# Altium schematic sheet Linux_board.va_1.SchDoc
size 843 x 659 mm
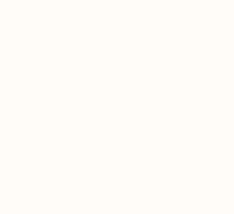
[diagram p0: Linux_board.va_1.SchDoc, top left]
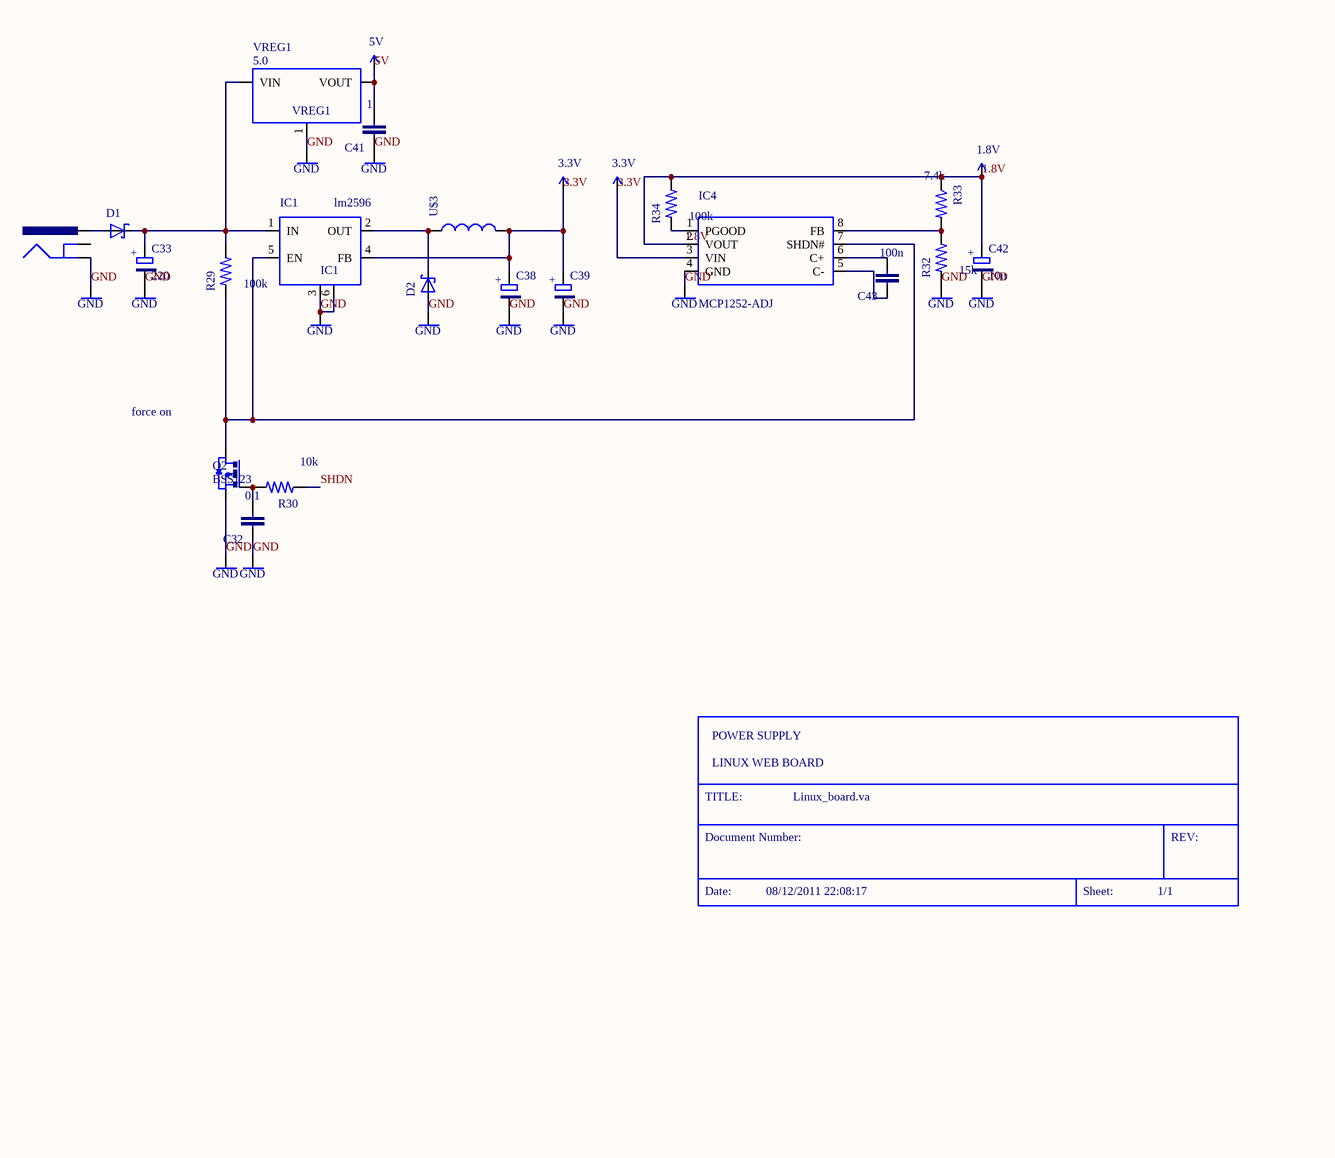
[diagram p1: Linux_board.va_1.SchDoc, top middle]
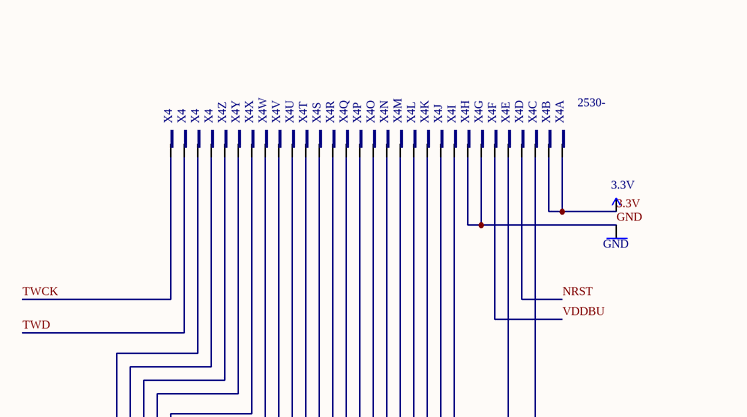
[diagram p2: Linux_board.va_1.SchDoc, top right]
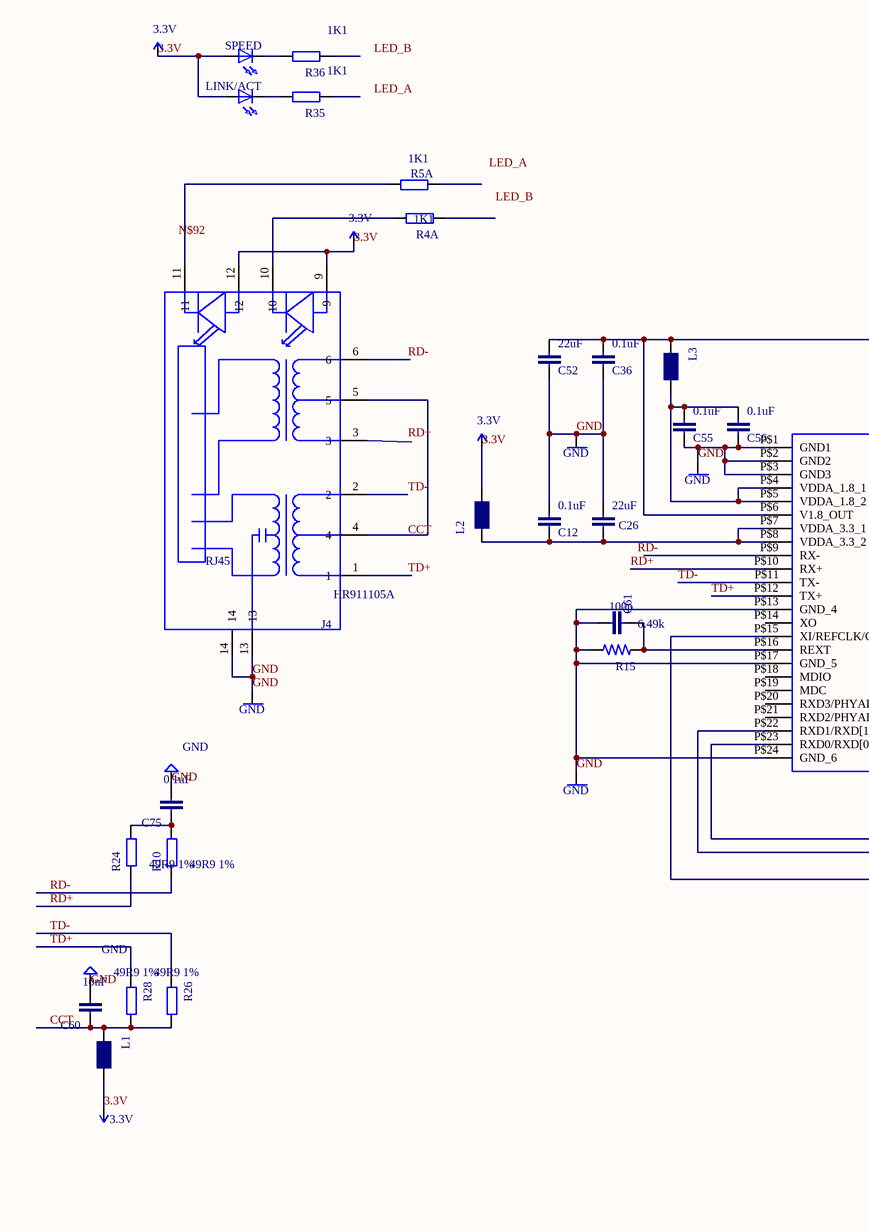
[diagram p3: Linux_board.va_1.SchDoc, bottom left]
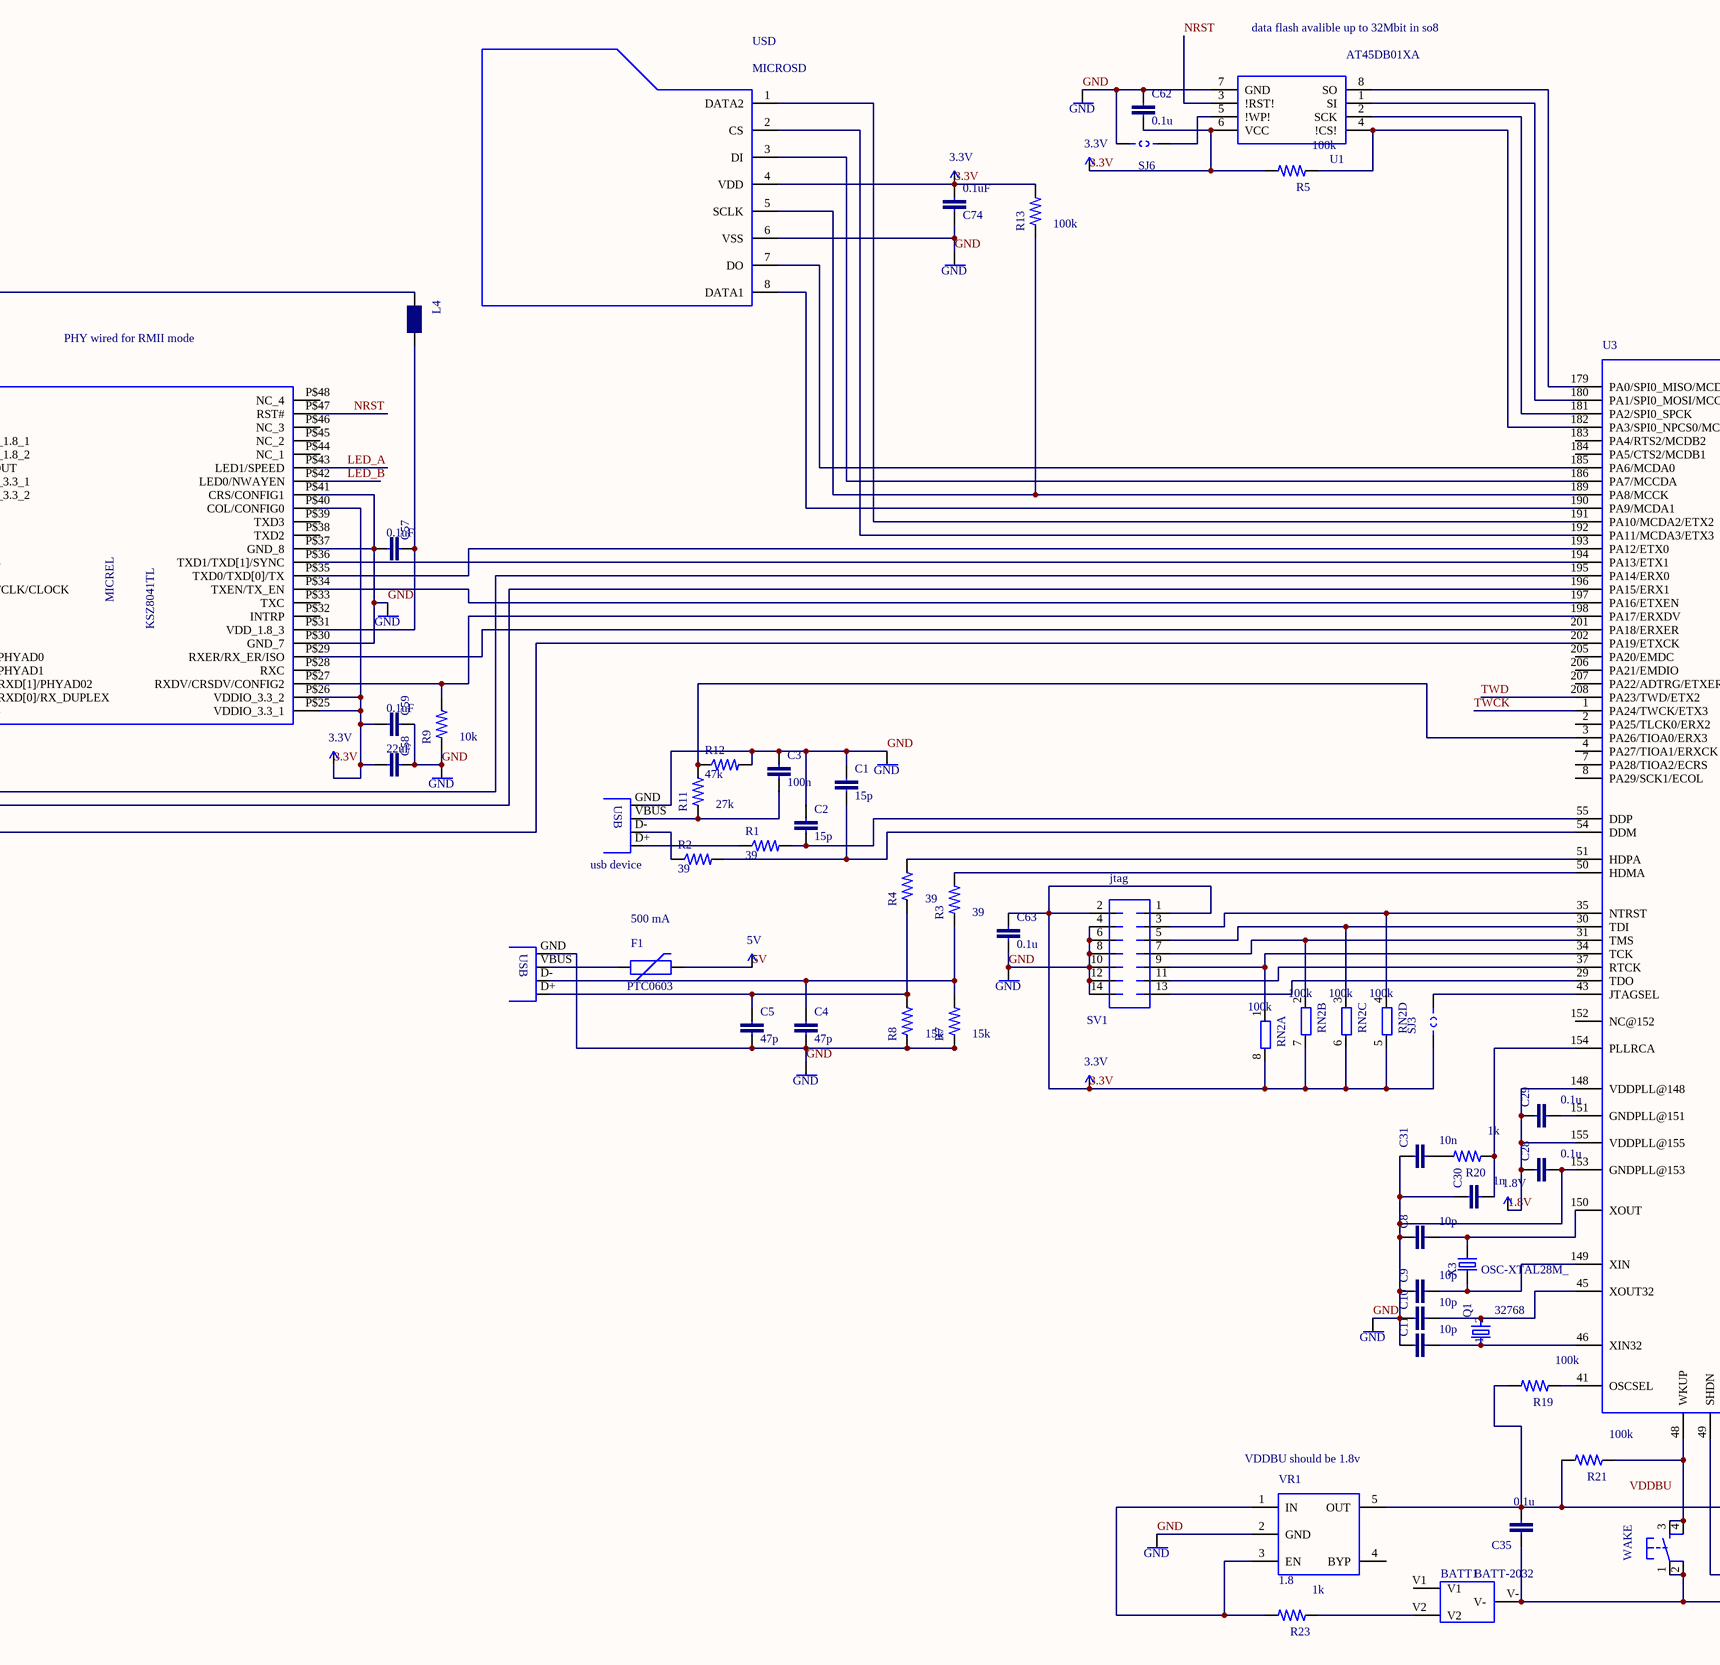
[diagram p4: Linux_board.va_1.SchDoc, bottom middle]
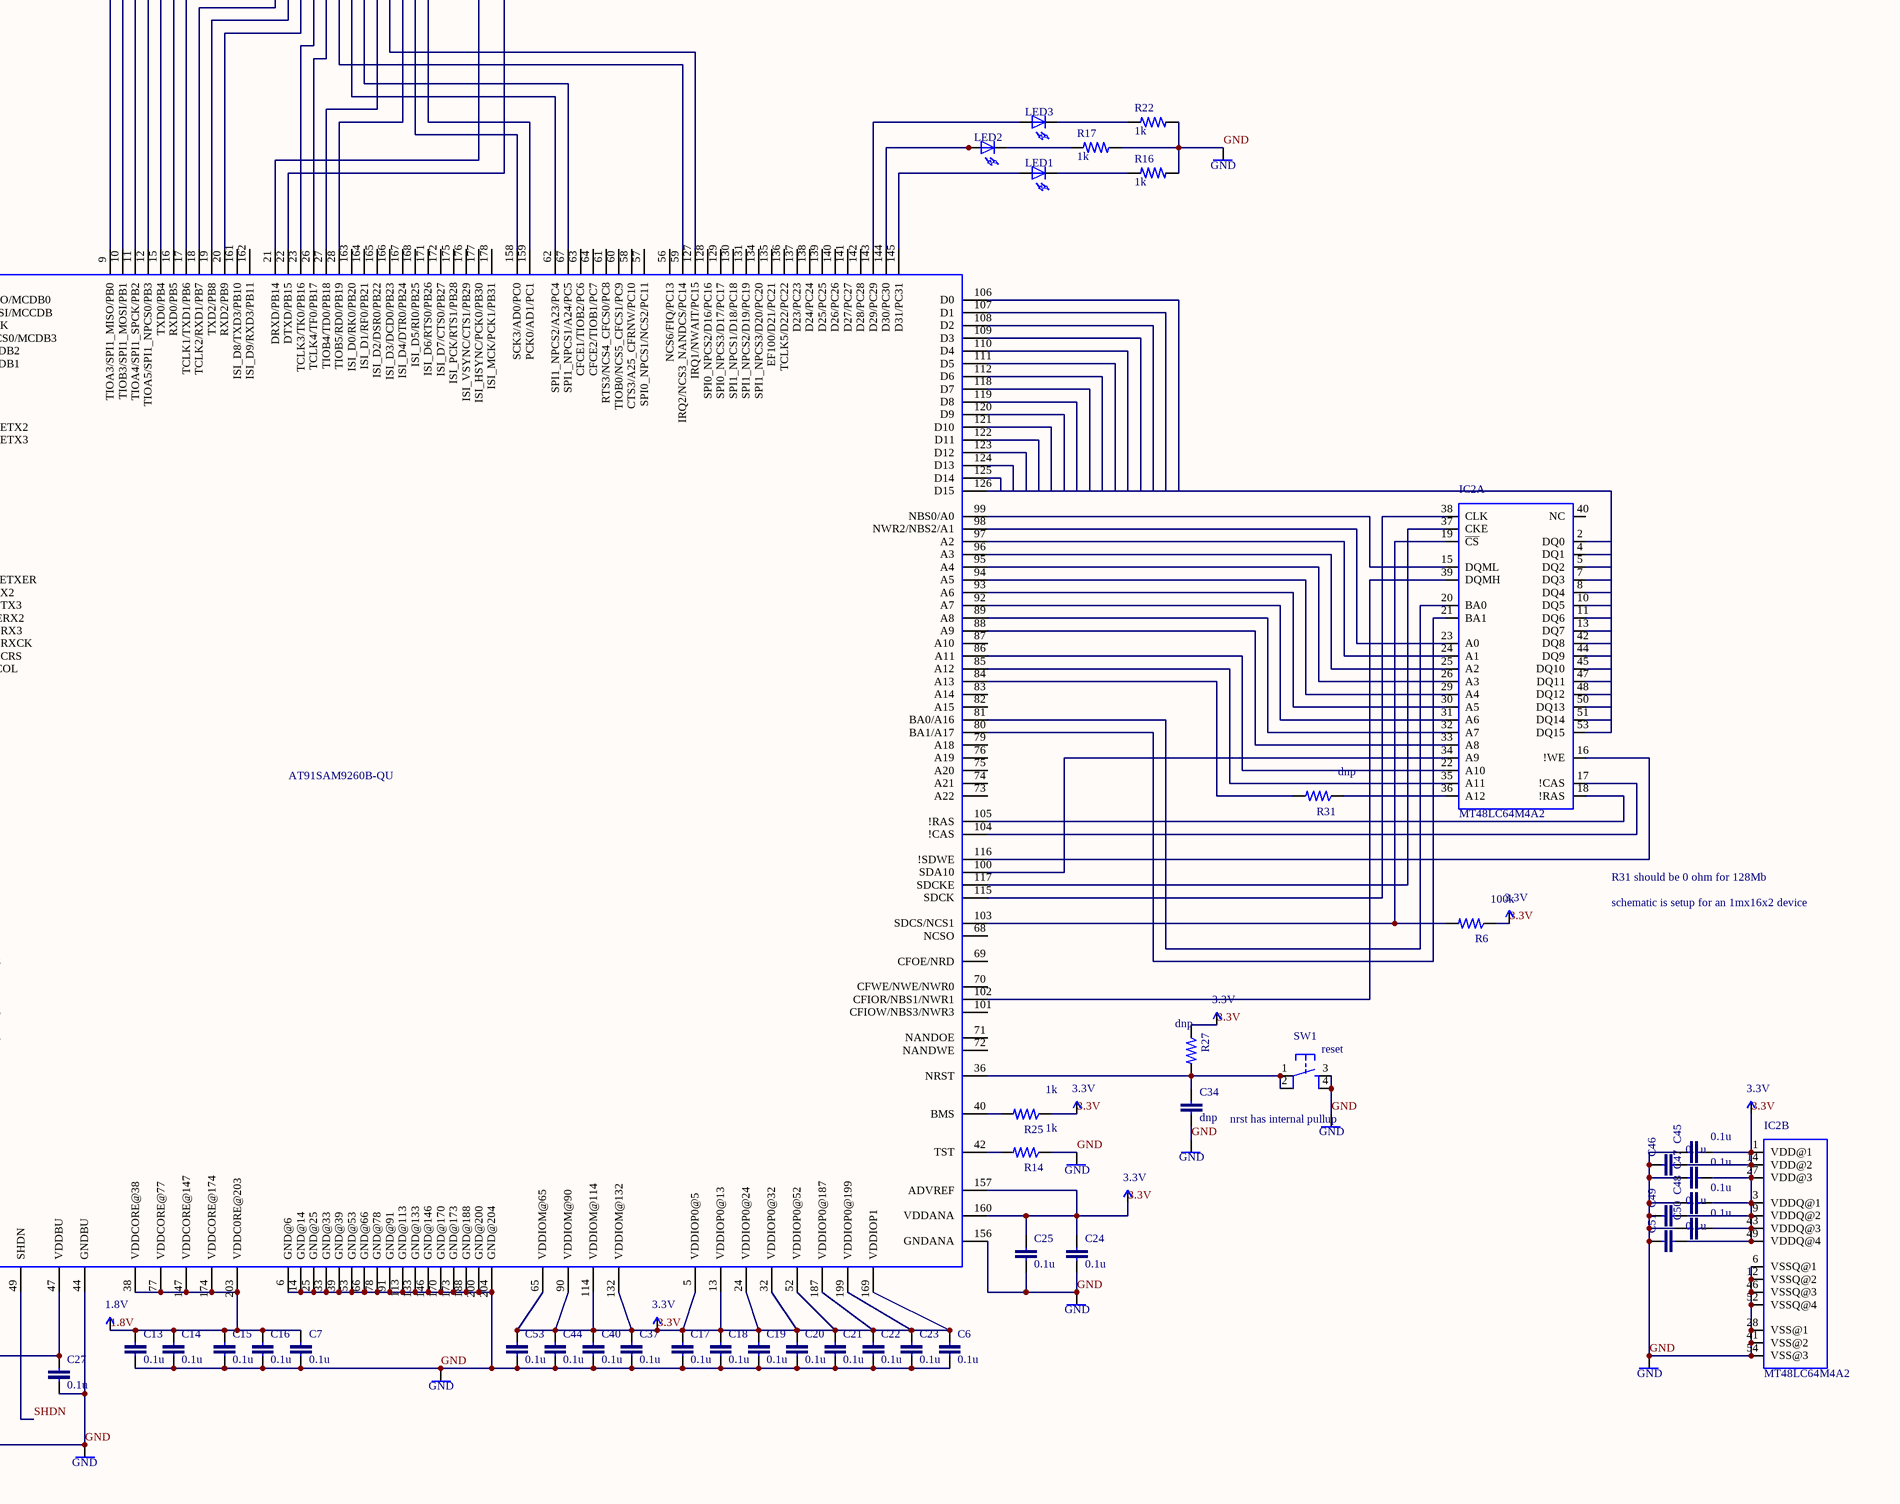
[diagram p5: Linux_board.va_1.SchDoc, bottom right]

## Parts
BATT1  BATT-2032  [2032]
C1  15p  [0603-CAP]
C2  15p  [0603-CAP]
C3  100n  [0603-CAP]
C4  47p  [0603-CAP]
C5  47p  [0603-CAP]
C6  0.1u  [0603-CAP]
C7  0.1u  [0603-CAP]
C8  10p  [0603-CAP]
C9  10p  [0603-CAP]
C10  10p  [0603-CAP]
C11  10p  [0603-CAP]
C12  0.1uF  [C0603]
C13  0.1u  [0603-CAP]
C14  0.1u  [0603-CAP]
C15  0.1u  [0603-CAP]
C16  0.1u  [0603-CAP]
C17  0.1u  [0603-CAP]
C18  0.1u  [0603-CAP]
C19  0.1u  [0603-CAP]
C20  0.1u  [0603-CAP]
C21  0.1u  [0603-CAP]
C22  0.1u  [0603-CAP]
C23  0.1u  [0603-CAP]
C24  0.1u  [0603-CAP]
C25  0.1u  [0603-CAP]
C26  22uF  [C0603]
C27  0.1u  [0603-CAP]
C28  0.1u  [0603-CAP]
C29  0.1u  [0603-CAP]
C30  1n  [0603-CAP]
C31  10n  [0603-CAP]
C32  0.1  [C603]
C33  220  [SMC_B]
C34  dnp  [0603-CAP]
C35  0.1u  [0603-CAP]
C36  0.1uF  [C0603]
C37  0.1u  [0603-CAP]
C38  (no value)  [CASE_A]
C39  (no value)  [SMC_B]
C40  0.1u  [0603-CAP]
C41  1  [C603]
C42  10u  [SMC_B]
C43  100n  [C603]
C44  0.1u  [0603-CAP]
C45  0.1u  [0603-CAP]
C46  0.1u  [0603-CAP]
C47  0.1u  [0603-CAP]
C48  0.1u  [0603-CAP]
C49  0.1u  [0603-CAP]
C50  0.1u  [0603-CAP]
C51  0.1u  [0603-CAP]
C52  22uF  [C0603]
C53  0.1u  [0603-CAP]
C55  0.1uF  [C0603]
C56  0.1uF  [C0603]
C57  0.1uF  [C0603]
C58  22uF  [C0603]
C59  0.1uF  [C0603]
C60  10uF  [C0603]
C61  100p  [C0603]
C62  0.1u  [0603-CAP]
C63  0.1u  [0603-CAP]
C74  0.1uF  [C0603]
C75  0.1uF  [C0603]
D1  (no value)  [SMB]
D2  (no value)  [SMB]
F1  PTC0603  [0603]
FRAME1  (no value)  (parts A,B of 2)
GND1  GND
GND2  GND
GND3  GND
GND4  GND
GND6  GND
GND7  GND
GND8  GND
GND9  GND
GND10  GND
GND11  GND
GND12  GND
GND13  GND
GND14  GND
GND15  GND
GND16  GND
GND17  GND
GND18  GND
GND19  GND
GND20  GND
GND21  GND
GND22  GND
GND23  GND
GND24  GND
GND25  GND
GND26  GND
GND27  GND
GND28  GND
GND29  GND
GND30  GND
GND31  GND
GND32  GND
GND33  GND
GND34  GND
GND35  GND
GND36  GND
IC1  lm2596  [TO263-5]
IC2  MT48LC64M4A2  [TSOP54-400]  (parts A,B of 2)
IC4  MCP1252-ADJ  [MSOP8]
J4  RJ45  [HR911105A]
JP1  (no value)  [STAND-OFF]
JP2  (no value)  [STAND-OFF]
JP3  (no value)  [STAND-OFF]
JP4  (no value)  [STAND-OFF]
L1  (no value)  [WE-KI_0805_B]
L2  (no value)  [WE-KI_0805_B]
L3  (no value)  [WE-KI_0805_B]
L4  (no value)  [WE-KI_0805_B]
LED1  (no value)  [CHIPLED_0805]
LED2  (no value)  [CHIPLED_0805]
LED3  (no value)  [CHIPLED_0805]
LINK/ACT  (no value)  [CHIPLED_0805]
P+1  3.3V
P+2  3.3V
P+3  3.3V
P+4  3.3V
P+5  3.3V
P+6  3.3V
P+7  3.3V
P+8  3.3V
P+9  3.3V
P+10  3.3V
P+11  3.3V
P+12  3.3V
P+13  3.3V
P+14  3.3V
P+15  3.3V
P+16  3.3V
P+17  3.3V
Q1  32768  [TC26H]
Q2  BSS123  [SOT23]
R1  39  [R0603]
R2  39  [R0603]
R3  39  [R0603]
R4  39  [R0603]
R4A  1K1  [R0603]
R5  100k  [R0603]
R5A  1K1  [R0603]
R6  100k  [R0603]
R7  15k  [R0603]
R8  15k  [R0603]
R9  10k  [R0603]
R10  49R9 1%  [R0603]
R11  27k  [R0603]
R12  47k  [R0603]
R13  100k  [R0603]
R14  1k  [R0603]
R15  6.49k  [R0603]
R16  1k  [R0603]
R17  1k  [R0603]
R19  100k  [R0603]
R20  1k  [R0603]
R21  100k  [R0603]
R22  1k  [R0603]
R23  1k  [R0603]
R24  49R9 1%  [R0603]
R25  1k  [R0603]
R26  49R9 1%  [R0603]
R27  dnp  [R0603]
R28  49R9 1%  [R0603]
R29  100k  [R0603]
R30  10k  [R0603]
R31  dnp  [R0603]
R32  15k  [R0603]
R33  7.4k  [R0603]
R34  100k  [R0603]
R35  1K1  [R0603]
R36  1K1  [R0603]
RN2  100k  [RN8P-4R-CRA06S]  (parts A,B,C,D of 4)
SJ3  (no value)  [SJ_2S-NO]
SJ6  (no value)  [SJ_2S-NO]
SPEED  (no value)  [CHIPLED_0805]
SV1  jtag  [MA07-2]
SW1  reset  [TACT_SWITCH_SMALL]
U1  AT45DB01XA  [SO08W]
U3  AT91SAM9260B-QU  [PQFP208]
U$1  (no value)  [48PIN-TQFN]
U$2  (no value)  [POWER_JACK_SMD]
U$3  (no value)  [CDRH125]
U$4  1.8V
U$5  1.8V
U$6  1.8V
U$7  5V
U$10  5V
USD  MICROSD  [MICROSD]
V7  GND
V8  GND
VR1  1.8  [SOT-23-5]
VREG1  5.0  [SOT223]
WAKE  (no value)  [TACT_SWITCH_SMALL]
X1  (no value)  [USB-MB-S]
X2  (no value)  [USB-A-H]
X3  OSC-XTAL28M_  [5X8]
X4  2530-  [PAK100/2500-30]  (parts A,B,C,D,E,F,G,H,I,J,K,L,M,N,O,P,Q,R,S,T,U,V,W,X,Y,Z,27,28,29,30 of 30)

## Nets
1.8V: C7.1 C13.1 C14.1 C15.1 C16.1 C28.1 C29.1 C42.+ IC4.2(VOUT) R33.1 R34.2 U3.38(VDDCORE@38) U3.77(VDDCORE@77) U3.147(VDDCORE@147) U3.148(VDDPLL@148) U3.155(VDDPLL@155) U3.174(VDDCORE@174) U3.203(VDDC0RE@203) U$4.0(1.8V) U$5.0(1.8V) U$6.0(1.8V)
3.3V: C6.1 C17.1 C18.1 C19.1 C20.1 C21.1 C22.1 C23.1 C24.1 C25.1 C37.1 C38.+ C39.+ C40.1 C44.1 C45.2 C46.2 C47.2 C48.2 C49.2 C50.2 C51.2 C53.1 C58.1 C59.1 C62.2 C63.1 C74.1 IC1.4(FB) IC2.1(VDD@1) IC2.3(VDDQ@1) IC2.9(VDDQ@2) IC2.14(VDD@2) IC2.27(VDD@3) IC2.43(VDDQ@3) IC2.49(VDDQ@4) IC4.3(VIN) J4.9 J4.12 L1.1 L2.1 LINK/ACT.A P+1.0(3.3V) P+2.0(3.3V) P+3.0(3.3V) P+4.0(3.3V) P+5.0(3.3V) P+6.0(3.3V) P+7.0(3.3V) P+8.0(3.3V) P+9.0(3.3V) P+10.0(3.3V) P+11.0(3.3V) P+12.0(3.3V) P+13.0(3.3V) P+14.0(3.3V) P+15.0(3.3V) P+16.0(3.3V) P+17.0(3.3V) R5.2 R6.1 R13.2 R25.1 R27.1 RN2.5 RN2.6 RN2.7 RN2.8 SJ3.1 SPEED.A SV1.1 SV1.2 U1.6(VCC) U3.5(VDDIOP0@5) U3.13(VDDIOP0@13) U3.24(VDDIOP0@24) U3.32(VDDIOP0@32) U3.52(VDDIOP0@52) U3.65(VDDIOM@65) U3.90(VDDIOM@90) U3.114(VDDIOM@114) U3.132(VDDIOM@132) U3.157(ADVREF) U3.160(VDDANA) U3.169(VDDIOP1) U3.187(VDDIOP0@187) U3.199(VDDIOP0@199) U$1.P$25(VDDIO_3.3_1) U$1.P$26(VDDIO_3.3_2) U$1.P$40(COL/CONFIG0) U$3.2 USD.4(VDD) X4.1(KL) X4.2(KL)
5V: C41.2 F1.2 U$7.0(5V) U$10.0(5V) VREG1.2(VOUT)
CCT: C60.1 L1.2 R26.2 R28.2
GND: BATT1.V- C1.1 C2.1 C3.1 C4.2 C5.2 C6.2 C7.2 C8.1 C9.1 C10.1 C11.1 C12.1 C13.2 C14.2 C15.2 C16.2 C17.2 C18.2 C19.2 C20.2 C21.2 C22.2 C23.2 C24.2 C25.2 C26.1 C27.2 C28.2 C30.1 C31.1 C32.1 C33.- C34.2 C35.1 C36.2 C37.2 C38.- C39.- C40.2 C41.1 C42.- C44.2 C45.1 C46.1 C47.1 C48.1 C49.1 C50.1 C51.1 C52.2 C53.2 C55.2 C56.2 C57.1 C58.2 C59.2 C60.2 C61.1 C62.1 C63.2 C74.2 C75.2 D2.A GND1.0(GND) GND2.0(GND) GND3.0(GND) GND4.0(GND) GND6.0(GND) GND7.0(GND) GND8.0(GND) GND9.0(GND) GND10.0(GND) GND11.0(GND) GND12.0(GND) GND13.0(GND) GND14.0(GND) GND15.0(GND) GND16.0(GND) GND17.0(GND) GND18.0(GND) GND19.0(GND) GND20.0(GND) GND21.0(GND) GND22.0(GND) GND23.0(GND) GND24.0(GND) GND25.0(GND) GND26.0(GND) GND27.0(GND) GND28.0(GND) GND29.0(GND) GND30.0(GND) GND31.0(GND) GND32.0(GND) GND33.0(GND) GND34.0(GND) GND35.0(GND) GND36.0(GND) IC1.3(GND) IC1.6(GND@1) IC2.6(VSSQ@1) IC2.12(VSSQ@2) IC2.28(VSS@1) IC2.41(VSS@2) IC2.46(VSSQ@3) IC2.52(VSSQ@4) IC2.54(VSS@3) IC4.4(GND) J4.13 J4.14 Q2.2(S) R7.1 R8.1 R9.1 R12.2 R14.1 R15.2 R16.2 R17.2 R22.2 R32.1 SJ6.2 SV1.4 SV1.6 SV1.8 SV1.10 SV1.12 SV1.14 SW1.3 SW1.4 U1.7(GND) U3.6(GND@6) U3.14(GND@14) U3.25(GND@25) U3.33(GND@33) U3.39(GND@39) U3.44(GNDBU) U3.53(GND@53) U3.66(GND@66) U3.78(GND@78) U3.91(GND@91) U3.113(GND@113) U3.133(GND@133) U3.146(GND@146) U3.153(GNDPLL@153) U3.156(GNDANA) U3.170(GND@170) U3.173(GND@173) U3.188(GND@188) U3.200(GND@200) U3.204(GND@204) U$1.P$1(GND1) U$1.P$2(GND2) U$1.P$3(GND3) U$1.P$13(GND_4) U$1.P$17(GND_5) U$1.P$24(GND_6) U$1.P$30(GND_7) U$1.P$37(GND_8) U$1.P$41(CRS/CONFIG1) U$2.P$4(GND@1) USD.6(VSS) V7.0(GND) V8.0(GND) VR1.2(GND) VREG1.1(GND) WAKE.1 WAKE.2 X1.GND X2.GND X4.7(KL) X4.8(KL)
LED_A: U$1.P$43(LED1/SPEED)
LED_B: U$1.P$42(LED0/NWAYEN)
NRST: U1.3(!RST!) U$1.P$47(RST#) X4.4(KL)
RD+: R24.1 U$1.P$10(RX+)
RD-: J4.6 R10.1
SHDN: R30.1 U3.49(SHDN)
TD+: J4.1 R28.1 U$1.P$12(TX+)
TD-: J4.2 R26.1 U$1.P$11(TX-)
TWCK: U3.1(PA24/TWCK/ETX3) X4.30(KL)
TWD: U3.208(PA23/TWD/ETX2) X4.29(KL)
VDDBU: X4.6(KL)
NetBATT1_V2: BATT1.V2 R23.1
NetC1_2: C1.2 R2.2 U3.54(DDM)
NetC2_2: C2.2 R1.2 U3.55(DDP)
NetC3_2: C3.2 R11.1 X1.VBUS
NetC4_1: C4.1 R3.1 R7.2 X2.D-
NetC5_1: C5.1 R4.1 R8.2 X2.D+
NetC8_2: C8.2 U3.150(XOUT) X3.2(X2)
NetC9_2: C9.2 U3.149(XIN) X3.1(X1)
NetC10_2: C10.2 Q1.2 U3.45(XOUT32)
NetC11_2: C11.2 Q1.1 U3.46(XIN32)
NetC12_2: C12.2 C26.2 L2.2 U$1.P$7(VDDA_3.3_1) U$1.P$8(VDDA_3.3_2)
NetC27_1: C27.1 C35.2 R19.2 R21.2 U3.47(VDDBU) VR1.5(OUT)
NetC29_2: C29.2 U3.151(GNDPLL@151)
NetC30_2: C30.2 R20.1 U3.154(PLLRCA)
NetC31_2: C31.2 R20.2
NetC32_2: C32.2 Q2.1(G) R30.2
NetC33_+: C33.+ D1.C IC1.1(IN) R29.2 VREG1.3(VIN)
NetC34_1: C34.1 R27.2 SW1.1 SW1.2 U3.36(NRST)
NetC36_1: C36.1 C52.1 L3.2 L4.2 U$1.P$6(V1.8_OUT)
NetC43_1: C43.1 IC4.5(C-)
NetC43_2: C43.2 IC4.6(C+)
NetC55_1: C55.1 C56.1 L3.1 U$1.P$4(VDDA_1.8_1) U$1.P$5(VDDA_1.8_2)
NetC57_2: C57.2 L4.1 U$1.P$31(VDD_1.8_3)
NetC61_2: C61.2 R15.1 U$1.P$16(REXT)
NetC75_1: C75.1 R10.2 R24.2
NetD1_A: D1.A U$2.VIN0(PWR)
NetD2_C: D2.C IC1.2(OUT) U$3.1
NetF1_1: F1.1 X2.VBUS
NetIC1_5: IC1.5(EN) IC4.7(SHDN#) Q2.3(D) R29.1
NetIC2_15: IC2.15(DQML) U3.99(NBS0/A0)
NetIC2_16: IC2.16(!WE) U3.116(!SDWE)
NetIC2_17: IC2.17(!CAS) U3.104(!CAS)
NetIC2_18: IC2.18(!RAS) U3.105(!RAS)
NetIC2_19: IC2.19(~{CS}) R6.2 U3.103(SDCS/NCS1)
NetIC2_20: IC2.20(BA0) U3.81(BA0/A16)
NetIC2_21: IC2.21(BA1) U3.80(BA1/A17)
NetIC2_22: IC2.22(A10) U3.86(A11)
NetIC2_23: IC2.23(A0) U3.98(NWR2/NBS2/A1)
NetIC2_24: IC2.24(A1) U3.97(A2)
NetIC2_25: IC2.25(A2) U3.96(A3)
NetIC2_26: IC2.26(A3) U3.95(A4)
NetIC2_29: IC2.29(A4) U3.94(A5)
NetIC2_30: IC2.30(A5) U3.93(A6)
NetIC2_31: IC2.31(A6) U3.92(A7)
NetIC2_32: IC2.32(A7) U3.89(A8)
NetIC2_33: IC2.33(A8) U3.88(A9)
NetIC2_34: IC2.34(A9) U3.100(SDA10)
NetIC2_35: IC2.35(A11) U3.85(A12)
NetIC2_36: IC2.36(A12) R31.1
NetIC2_37: IC2.37(CKE) U3.117(SDCKE)
NetIC2_38: IC2.38(CLK) U3.115(SDCK)
NetIC2_39: IC2.39(DQMH) U3.102(CFIOR/NBS1/NWR1)
NetIC4_1: IC4.1(PGOOD) R34.1
NetIC4_8: IC4.8(FB) R32.2 R33.2
NetJ4_4: J4.4 J4.5
NetJ4_10: J4.10 R4A.2
NetJ4_11: J4.11 R5A.2
NetLED1_A: LED1.A U3.145(D31/PC31)
NetLED1_C: LED1.C R16.1
NetLED2_A: LED2.A U3.144(D30/PC30)
NetLED2_C: LED2.C R17.1
NetLED3_A: LED3.A U3.143(D29/PC29)
NetLED3_C: LED3.C R22.1
NetLINK/ACT_C: LINK/ACT.C R35.2
NetR1_1: R1.1 X1.D+
NetR2_1: R2.1 X1.D-
NetR3_2: R3.2 U3.50(HDMA)
NetR4_2: R4.2 U3.51(HDPA)
NetR5_1: R5.1 U1.4(!CS!) U3.182(PA3/SPI0_NPCS0/MCDB3)
NetR9_2: R9.2 U3.198(PA17/ERXDV) U$1.P$27(RXDV/CRSDV/CONFIG2)
NetR11_2: R11.2 R12.1 U3.3(PA26/TIOA0/ERX3)
NetR13_1: R13.1 U3.189(PA8/MCCK) USD.5(SCLK)
NetR14_2: R14.2 U3.42(TST)
NetR19_1: R19.1 U3.41(OSCSEL)
NetR21_1: R21.1 U3.48(WKUP) WAKE.3 WAKE.4
NetR23_2: R23.2 VR1.1(IN) VR1.3(EN)
NetR25_2: R25.2 U3.40(BMS)
NetR31_2: R31.2 U3.84(A13)
NetR36_2: R36.2 SPEED.C
NetRN2_1: RN2.1 SV1.9 U3.34(TCK)
NetRN2_2: RN2.2 SV1.7 U3.31(TMS)
NetRN2_3: RN2.3 SV1.5 U3.30(TDI)
NetRN2_4: RN2.4 SV1.3 U3.35(NTRST)
NetSJ3_2: SJ3.2 U3.43(JTAGSEL)
NetSJ6_1: SJ6.1 U1.5(!WP!)
NetSV1_11: SV1.11 U3.37(RTCK)
NetSV1_13: SV1.13 U3.29(TDO)
NetU1_1: U1.1(SI) U3.180(PA1/SPI0_MOSI/MCCDB)
NetU1_2: U1.2(SCK) U3.181(PA2/SPI0_SPCK)
NetU1_8: U1.8(SO) U3.179(PA0/SPI0_MISO/MCDB0)
NetU3_9: U3.9(TIOA3/SPI1_MISO/PB0) X4.28(KL)
NetU3_10: U3.10(TIOB3/SPI1_MOSI/PB1) X4.27(KL)
NetU3_11: U3.11(TIOA4/SPI1_SPCK/PB2) X4.26(KL)
NetU3_12: U3.12(TIOA5/SPI1_NPCS0/PB3) X4.25(KL)
NetU3_15: U3.15(TXD0/PB4) X4.24(KL)
NetU3_16: U3.16(RXD0/PB5) X4.23(KL)
NetU3_17: U3.17(TCLK1/TXD1/PB6) X4.22(KL)
NetU3_18: U3.18(TCLK2/RXD1/PB7) X4.21(KL)
NetU3_19: U3.19(TXD2/PB8) X4.20(KL)
NetU3_20: U3.20(RXD2/PB9) X4.19(KL)
NetU3_21: U3.21(DRXD/PB14) X4.5(KL)
NetU3_22: U3.22(DTXD/PB15) X4.3(KL)
NetU3_23: U3.23(TCLK3/TK0/PB16) X4.18(KL)
NetU3_26: U3.26(TCLK4/TF0/PB17) X4.17(KL)
NetU3_27: U3.27(TIOB4/TD0/PB18) X4.13(KL)
NetU3_28: U3.28(TIOB5/RD0/PB19) X4.11(KL)
NetU3_59: U3.59(IRQ2/NCS3_NANDCS/PC14) X4.16(KL)
NetU3_62: U3.62(SPI1_NPCS2/A23/PC4) X4.15(KL)
NetU3_67: U3.67(SPI1_NPCS1/A24/PC5) X4.14(KL)
NetU3_125: U3.125(D14) U3.126(D15)
NetU3_127: U3.127(IRQ1/NWAIT/PC15) X4.12(KL)
NetU3_158: U3.158(SCK3/AD0/PC0) X4.10(KL)
NetU3_159: U3.159(PCK0/AD1/PC1) X4.9(KL)
NetU3_185: U3.185(PA6/MCDA0) USD.7(DO)
NetU3_186: U3.186(PA7/MCCDA) USD.3(DI)
NetU3_190: U3.190(PA9/MCDA1) USD.8(DATA1)
NetU3_191: U3.191(PA10/MCDA2/ETX2) USD.1(DATA2)
NetU3_192: U3.192(PA11/MCDA3/ETX3) USD.2(CS)
NetU3_193: U3.193(PA12/ETX0) U$1.P$35(TXD0/TXD[0]/TX)
NetU3_194: U3.194(PA13/ETX1) U$1.P$36(TXD1/TXD[1]/SYNC)
NetU3_195: U3.195(PA14/ERX0) U$1.P$23(RXD0/RXD[0]/RX_DUPLEX)
NetU3_196: U3.196(PA15/ERX1) U$1.P$22(RXD1/RXD[1]/PHYAD02)
NetU3_197: U3.197(PA16/ETXEN) U$1.P$34(TXEN/TX_EN)
NetU3_201: U3.201(PA18/ERXER) U$1.P$29(RXER/RX_ER/ISO)
NetU3_202: U3.202(PA19/ETXCK) U$1.P$15(XI/REFCLK/CLOCK)

Not connected (* = marked no-connect by the designer): BATT1 V1; IC2 2(DQ0) 4(DQ1) 5(DQ2) 7(DQ3) 8(DQ4) 10(DQ5) 11(DQ6) 13(DQ7) 40(NC) 42(DQ8) 44(DQ9) 45(DQ10) 47(DQ11) 48(DQ12) 50(DQ13) 51(DQ14) 53(DQ15); J4 3; R4A 1; R5A 1; R35 1; R36 1; U3 2(PA25/TLCK0/ERX2) 4(PA27/TIOA1/ERXCK) 7(PA28/TIOA2/ECRS) 8(PA29/SCK1/ECOL) 56(NCS6/FIQ/PC13) 57(SPI0_NPCS1/NCS2/PC11) 58(CTS3/A25_CFRNW/PC10) 60(TIOB0/NCS5_CFCS1/PC9) 61(RTS3/NCS4_CFCS0/PC8) 63(CFCE1/TIOB2/PC6) 64(CFCE2/TIOB1/PC7) 68(NCSO) 69(CFOE/NRD) 70(CFWE/NWE/NWR0) 71(NANDOE) 72(NANDWE) 73(A22) 74(A21) 75(A20) 76(A19) 79(A18) 82(A15) 83(A14) 87(A10) 101(CFIOW/NBS3/NWR3) 106(D0) 107(D1) 108(D2) 109(D3) 110(D4) 111(D5) 112(D6) 118(D7) 119(D8) 120(D9) 121(D10) 122(D11) 123(D12) 124(D13) 128(SPI0_NPCS2/D16/PC16) 129(SPI0_NPCS3/D17/PC17) 130(SPI1_NPCS1/D18/PC18) 131(SPI1_NPCS2/D19/PC19) 134(SPI1_NPCS3/D20/PC20) 135(EF100/D21/PC21) 136(TCLK5/D22/PC22) 137(D23/PC23) 138(D24/PC24) 139(D25/PC25) 140(D26/PC26) 141(D27/PC27) 142(D28/PC28) 152(NC@152) 161(ISI_D8/TXD3/PB10) 162(ISI_D9/RXD3/PB11) 163(ISI_D0/RK0/PB20) 164(ISI_D1/RF0/PB21) 165(ISI_D2/DSR0/PB22) 166(ISI_D3/DCD0/PB23) 167(ISI_D4/DTR0/PB24) 168(ISI_D5/RI0/PB25) 171(ISI_D6/RTS0/PB26) 172(ISI_D7/CTS0/PB27) 175(ISI_PCK/RTS1/PB28) 176(ISI_VSYNC/CTS1/PB29) 177(ISI_HSYNC/PCK0/PB30) 178(ISI_MCK/PCK1/PB31) 183(PA4/RTS2/MCDB2) 184(PA5/CTS2/MCDB1) 205(PA20/EMDC) 206(PA21/EMDIO) 207(PA22/ADTRG/ETXER); U$1 P$9(RX-) P$14(XO) P$18(MDIO) P$19(MDC) P$20(RXD3/PHYAD0) P$21(RXD2/PHYAD1) P$28(RXC) P$32(INTRP) P$33(TXC) P$38(TXD2) P$39(TXD3) P$44(NC_1) P$45(NC_2) P$46(NC_3) P$48(NC_4); U$2 GND; VR1 4(BYP)

## Notes on the sheet
- force on
- LINUX WEB BOARD
- POWER SUPPLY
- data flash avalible up to 32Mbit in so8
- PHY wired for RMII mode
- (near X1) usb device
- 500 mA
- R31 should be 0 ohm for 128Mb
- schematic is setup for an 1mx16x2 device
- (near GND24) nrst has internal pullup
- (near VR1) VDDBU should be 1.8v
- Labels drawn without touching a wire or pin: CCT, LED_A, LED_B, N$92, RD+, RD-, VDDBU
- (in symbol FRAME_A_L, part B) TITLE:; Linux_board.va; Document Number:; REV:; Date:; 08/12/2011 22:08:17; Sheet:; 1/1
- (in symbol KSZ8041TL) MICREL
- (in symbol USB-A-H) USB
- (in symbol USB-MB-S) USB

## Library data of the parts
C1-C11 C13-C25 C27-C31 C34 C35 C37 C40 C44-C51 C53 C62 C63 = CAP0603-CAP
C12 C26 C36 C52 C55-C61 C74 C75 = C-EUC0603
C32 C41 C43 = CAPC603
C33 C39 C42 = CAP_POLSMC_B
C38 = CAP_POLCASE_A
D1 D2 = SCHOTTKY-DIODESMD
FRAME1 = FRAME_A_L
IC1 = LM2596S
J4 = HR911105A
JP1-JP4 = STAND-OFF
L1-L4 = WE-KIL_0805
LED1-LED3 LINK/ACT SPEED = LEDCHIPLED_0805
Q1 = CRYSTALTC26H
R1-R9 R11-R17 R19-R23 R25 R27 R29-R34 = R-US_R0603
R4A R5A R10 R24 R26 R28 R35 R36 = R-EU_R0603
RN2 = RNETWORK
SJ3 SJ6 = SOLDERJUMPERNO
SV1 = MA07-2
SW1 WAKE = SW-SMD-SMALL
U$1 = KSZ8041TL
U$2 = POWER_JACKSMD
U$3 = INDUCTORPWR
VR1 = MIC5205
VREG1 = LD1117-3.3SOT223
X1 = USB-MB-S
X2 = USB-A-H